# Altium schematic sheet 15-DistanceSRF05.SchDoc
size A4; DocumentNumber: 15; SheetNumber: 15; SheetTotal: 26
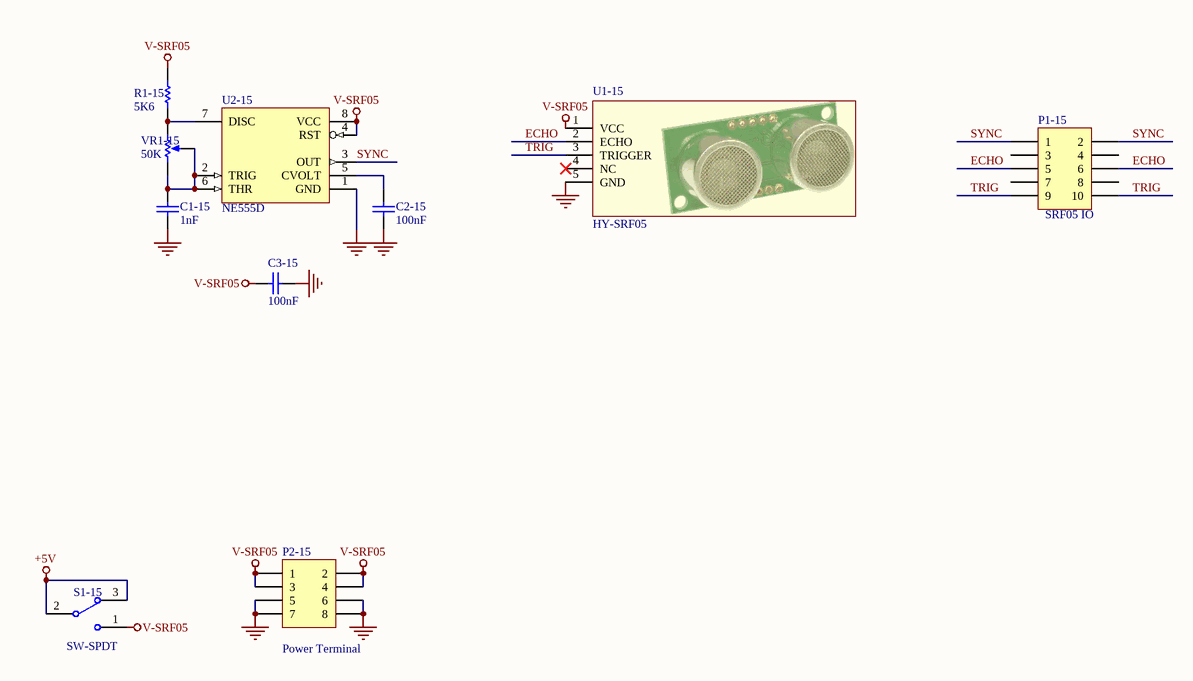
[diagram p0: 15-DistanceSRF05.SchDoc]

## Parts
C1-15  value 1nF  [c-0805]  (hidden comment: 102)
C2-15  value 100nF  [c-0805]  (hidden comment: 104)
C3-15  value 100nF  [c-0805]  (hidden comment: 104)
P1-15  value SRF05 IO  [JP2.54-F-2x05A]  (hidden comment: Header 5X2)
P2-15  Publisher: Power Terminal  [JP2.54-F-2x04A]  (hidden comment: Header 4X2)
R1-15  value 5K6  [R-0805]  (hidden comment: 562)
S1-15  SW-SPDT  [SW-SLIDE-2P-2W]
U1-15  HY-SRF05  [MDL-SRF05A]
U2-15  NE555D  [SOIC-8]
VR1-15  50K  [VR-3362P]

## Nets
+5V: S1-15.2 S1-15.3
GND: C1-15.1 C2-15.1 C3-15.1 P2-15.5 P2-15.6 P2-15.7 P2-15.8 U1-15.5(GND) U2-15.1(GND)
V-SRF05: C3-15.2 P2-15.1 P2-15.2 P2-15.3 P2-15.4 R1-15.2 S1-15.1 U1-15.1(VCC) U2-15.4(RST) U2-15.8(VCC)
ECHO: P1-15.5 P1-15.6 U1-15.2(ECHO)
SYNC: P1-15.1 P1-15.2 U2-15.3(OUT)
TRIG: P1-15.9 P1-15.10 U1-15.3(TRIGGER)
NetC1-15_2: C1-15.2 U2-15.2(TRIG) U2-15.6(THR) VR1-15.1(TOP) VR1-15.2(TAP)
NetC2-15_2: C2-15.2 U2-15.5(CVOLT)
NetR1-15_1: R1-15.1 U2-15.7(DISC) VR1-15.3(BOT)

Not connected (* = marked no-connect by the designer): P1-15 3 4 7 8; U1-15 4(NC)*

## Library data of the parts
C1-15 C2-15 C3-15 = Cap: Capacitor; Published: 8-Jun-2000; LatestRevisionDate: 17-Jul-2002; LatestRevisionNote: Re-released for DXP Platform.; PackageReference: RAD-0.3; Publisher: Altium Limited
P1-15 = Header 5X2: Header, 5-Pin, Dual row; LatestRevisionDate: 17-Jul-2002; LatestRevisionNote: Re-released for DXP Platform.
P2-15 = Header 4X2: Header, 4-Pin, Dual row; LatestRevisionDate: 17-Jul-2002; LatestRevisionNote: Re-released for DXP Platform.
R1-15 = Res1: Resistor; Published: 8-Jun-2000; LatestRevisionDate: 17-Jul-2002; LatestRevisionNote: Re-released for DXP Platform.; PackageReference: AXIAL-0.3; Publisher: Altium Limited
S1-15 = SW-SPDT: SPDT Subminiature Toggle Switch, Right Angle Mounting, Vertical Actuation; Published: 24-Mar-1999; LatestRevisionDate: 17-Dec-2003; LatestRevisionNote: Schematic revised, PCB Footprint replaced.; DatasheetVersion: 05-Dec-2000; PackageReference: TL36WW15050; Publisher: Altium Limited; PackageDescription: Switch; 4 Leads; ComponentLink1Description: Manufacturer Link; ComponentLink1URL: http://www.apem.com
U2-15 = NE555D: General-Purpose Single Bipolar Timer; Published: 24-Aug-2001; LatestRevisionDate: 13-Apr-2006; LatestRevisionNote: IPC-7351 Footprint Added.; DatasheetVersion: Jul-1998; PackageVersion: Dec-2002; PackageReference: SO8; Publisher: Altium Limited; PackageDescription: 8-Pin Small Outline Integrated Circuit 1.27 mm Pitch; Code_JEDEC: MS-012-AA; Code_IPC: SOIC127P600-8; ComponentLink1Description: Manufacturer Link; ComponentLink1URL: http://www.st.com/; ComponentLink2Description: Datasheet; ComponentLink2URL: http://www.st.com/stonline/products/literature/ds/2182/ne555.pdf
VR1-15 = RPot: Potentiometer; Sim Note: Enter the Resistance value and the set point into parameter fields.; Set Position: 0.5; Published: 8-Jun-2000; LatestRevisionDate: 17-Jul-2002; LatestRevisionNote: Re-released for DXP Platform.; PackageReference: VR5; Publisher: Altium Limited; Value: 50K